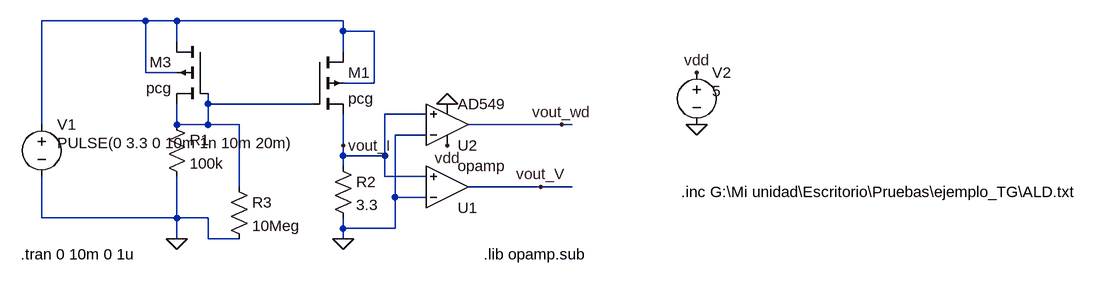
[diagram p0: schematic vccs.asc]
vccs.asc, the LTspice schematic file:
Version 4
SHEET 1 880 680
WIRE -640 -96 -800 -96
WIRE -592 -96 -640 -96
WIRE -336 -96 -592 -96
WIRE -336 -80 -336 -96
WIRE -288 -80 -336 -80
WIRE -592 -64 -592 -96
WIRE -336 -48 -336 -80
WIRE -640 -16 -640 -96
WIRE -592 -16 -640 -16
WIRE -288 0 -288 -80
WIRE -288 0 -336 0
WIRE -544 32 -544 16
WIRE -384 32 -544 32
WIRE -208 48 -272 48
WIRE -800 64 -800 -96
WIRE -592 64 -592 32
WIRE -544 64 -544 32
WIRE -544 64 -592 64
WIRE -496 64 -544 64
WIRE 0 64 -144 64
WIRE 16 64 0 64
WIRE -208 80 -256 80
WIRE -336 96 -336 48
WIRE -336 112 -336 96
WIRE -272 112 -272 48
WIRE -272 112 -336 112
WIRE -336 128 -336 112
WIRE -272 144 -272 112
WIRE -208 144 -272 144
WIRE -496 160 -496 64
WIRE -32 160 -144 160
WIRE 16 160 -32 160
WIRE -256 176 -256 80
WIRE -208 176 -256 176
WIRE -800 208 -800 144
WIRE -592 208 -592 144
WIRE -592 208 -800 208
WIRE -544 208 -592 208
WIRE -336 224 -336 208
WIRE -256 224 -256 176
WIRE -256 224 -336 224
WIRE -592 240 -592 208
WIRE -544 240 -544 208
WIRE -496 240 -544 240
WIRE -336 240 -336 224
FLAG -592 240 0
FLAG -336 240 0
FLAG -336 96 vout_I
FLAG -32 160 vout_V
FLAG 0 64 vout_wd
FLAG 208 64 0
FLAG -176 32 0
FLAG 208 -16 vdd
FLAG -176 96 vdd
SYMBOL res -608 48 R0
SYMATTR InstName R1
SYMATTR Value 100k
SYMBOL voltage -800 48 R0
WINDOW 3 24 44 Left 2
WINDOW 123 0 0 Left 0
WINDOW 39 0 0 Left 0
SYMATTR Value PULSE(0 3.3 0 10m 1n 10m 20m)
SYMATTR InstName V1
SYMBOL res -352 112 R0
SYMATTR InstName R2
SYMATTR Value 3.3
SYMBOL pmos4 -544 -64 M0
SYMATTR InstName M3
SYMATTR Value pcg
SYMATTR Value2 l=7.8e-6 w=0.138e-3 ad=0.161e-8 as=0.603e-8 ps=ps m=1
SYMBOL pmos4 -384 -48 R0
SYMATTR InstName M1
SYMATTR Value pcg
SYMATTR Value2 l=7.8e-6 w=0.138e-3 ad=0.161e-8 as=0.603e-8 ps=ps m=1
SYMBOL OpAmps\\opamp -176 224 M180
SYMATTR InstName U1
SYMBOL OpAmps\\AD549 -176 128 M180
SYMATTR InstName U2
SYMBOL voltage 208 -32 R0
WINDOW 3 24 44 Left 2
WINDOW 123 0 0 Left 0
WINDOW 39 0 0 Left 0
SYMATTR Value 5
SYMATTR InstName V2
SYMBOL res -512 144 R0
SYMATTR InstName R3
SYMATTR Value 10Meg
TEXT 184 168 Left 2 !.inc G:\\Mi unidad\\Escritorio\\Pruebas\\ejemplo_TG\\ALD.txt
TEXT -832 264 Left 2 !.tran 0 10m 0 1u
TEXT -120 264 Left 2 !.lib opamp.sub

The netlist it stands for:
* vccs.asc
R1 N002 0 100k
V1 N001 0 PULSE(0 3.3 0 10m 1n 10m 20m)
R2 vout_I 0 3.3
M3 N001 N002 N002 N001 pcg l=7.8e-6 w=0.138e-3 ad=0.161e-8 as=0.603e-8 ps=ps m=1
M1 N001 N002 vout_I N001 pcg l=7.8e-6 w=0.138e-3 ad=0.161e-8 as=0.603e-8 ps=ps m=1
XU1 0 vout_I vout_V opamp Aol=100K GBW=10Meg  ; pins invin noninvin out
XU2 vout_I 0 vdd 0 vout_wd AD549  ; pins In+ In- V+ V- OUT
V2 vdd 0 5
R3 N002 0 10Meg
.model NMOS NMOS
.model PMOS PMOS
.lib standard.mos
.inc G:\Mi unidad\Escritorio\Pruebas\ejemplo_TG\ALD.txt
.tran 0 10m 0 1u
.lib opamp.sub
.backanno
.end